# Altium project S7CAS-PLEIADES-CARTE-MERE_Pxx.PrjPcb (part 5 of 5)

## Sheet S7CAS-PLEIADES-CARTE-MERE_TO_BE_DELETED.SchDoc
size Tabloid; SheetNumber: 18; SheetTotal: 18; Size: 11x17; Sheet_Name: Sheet Description
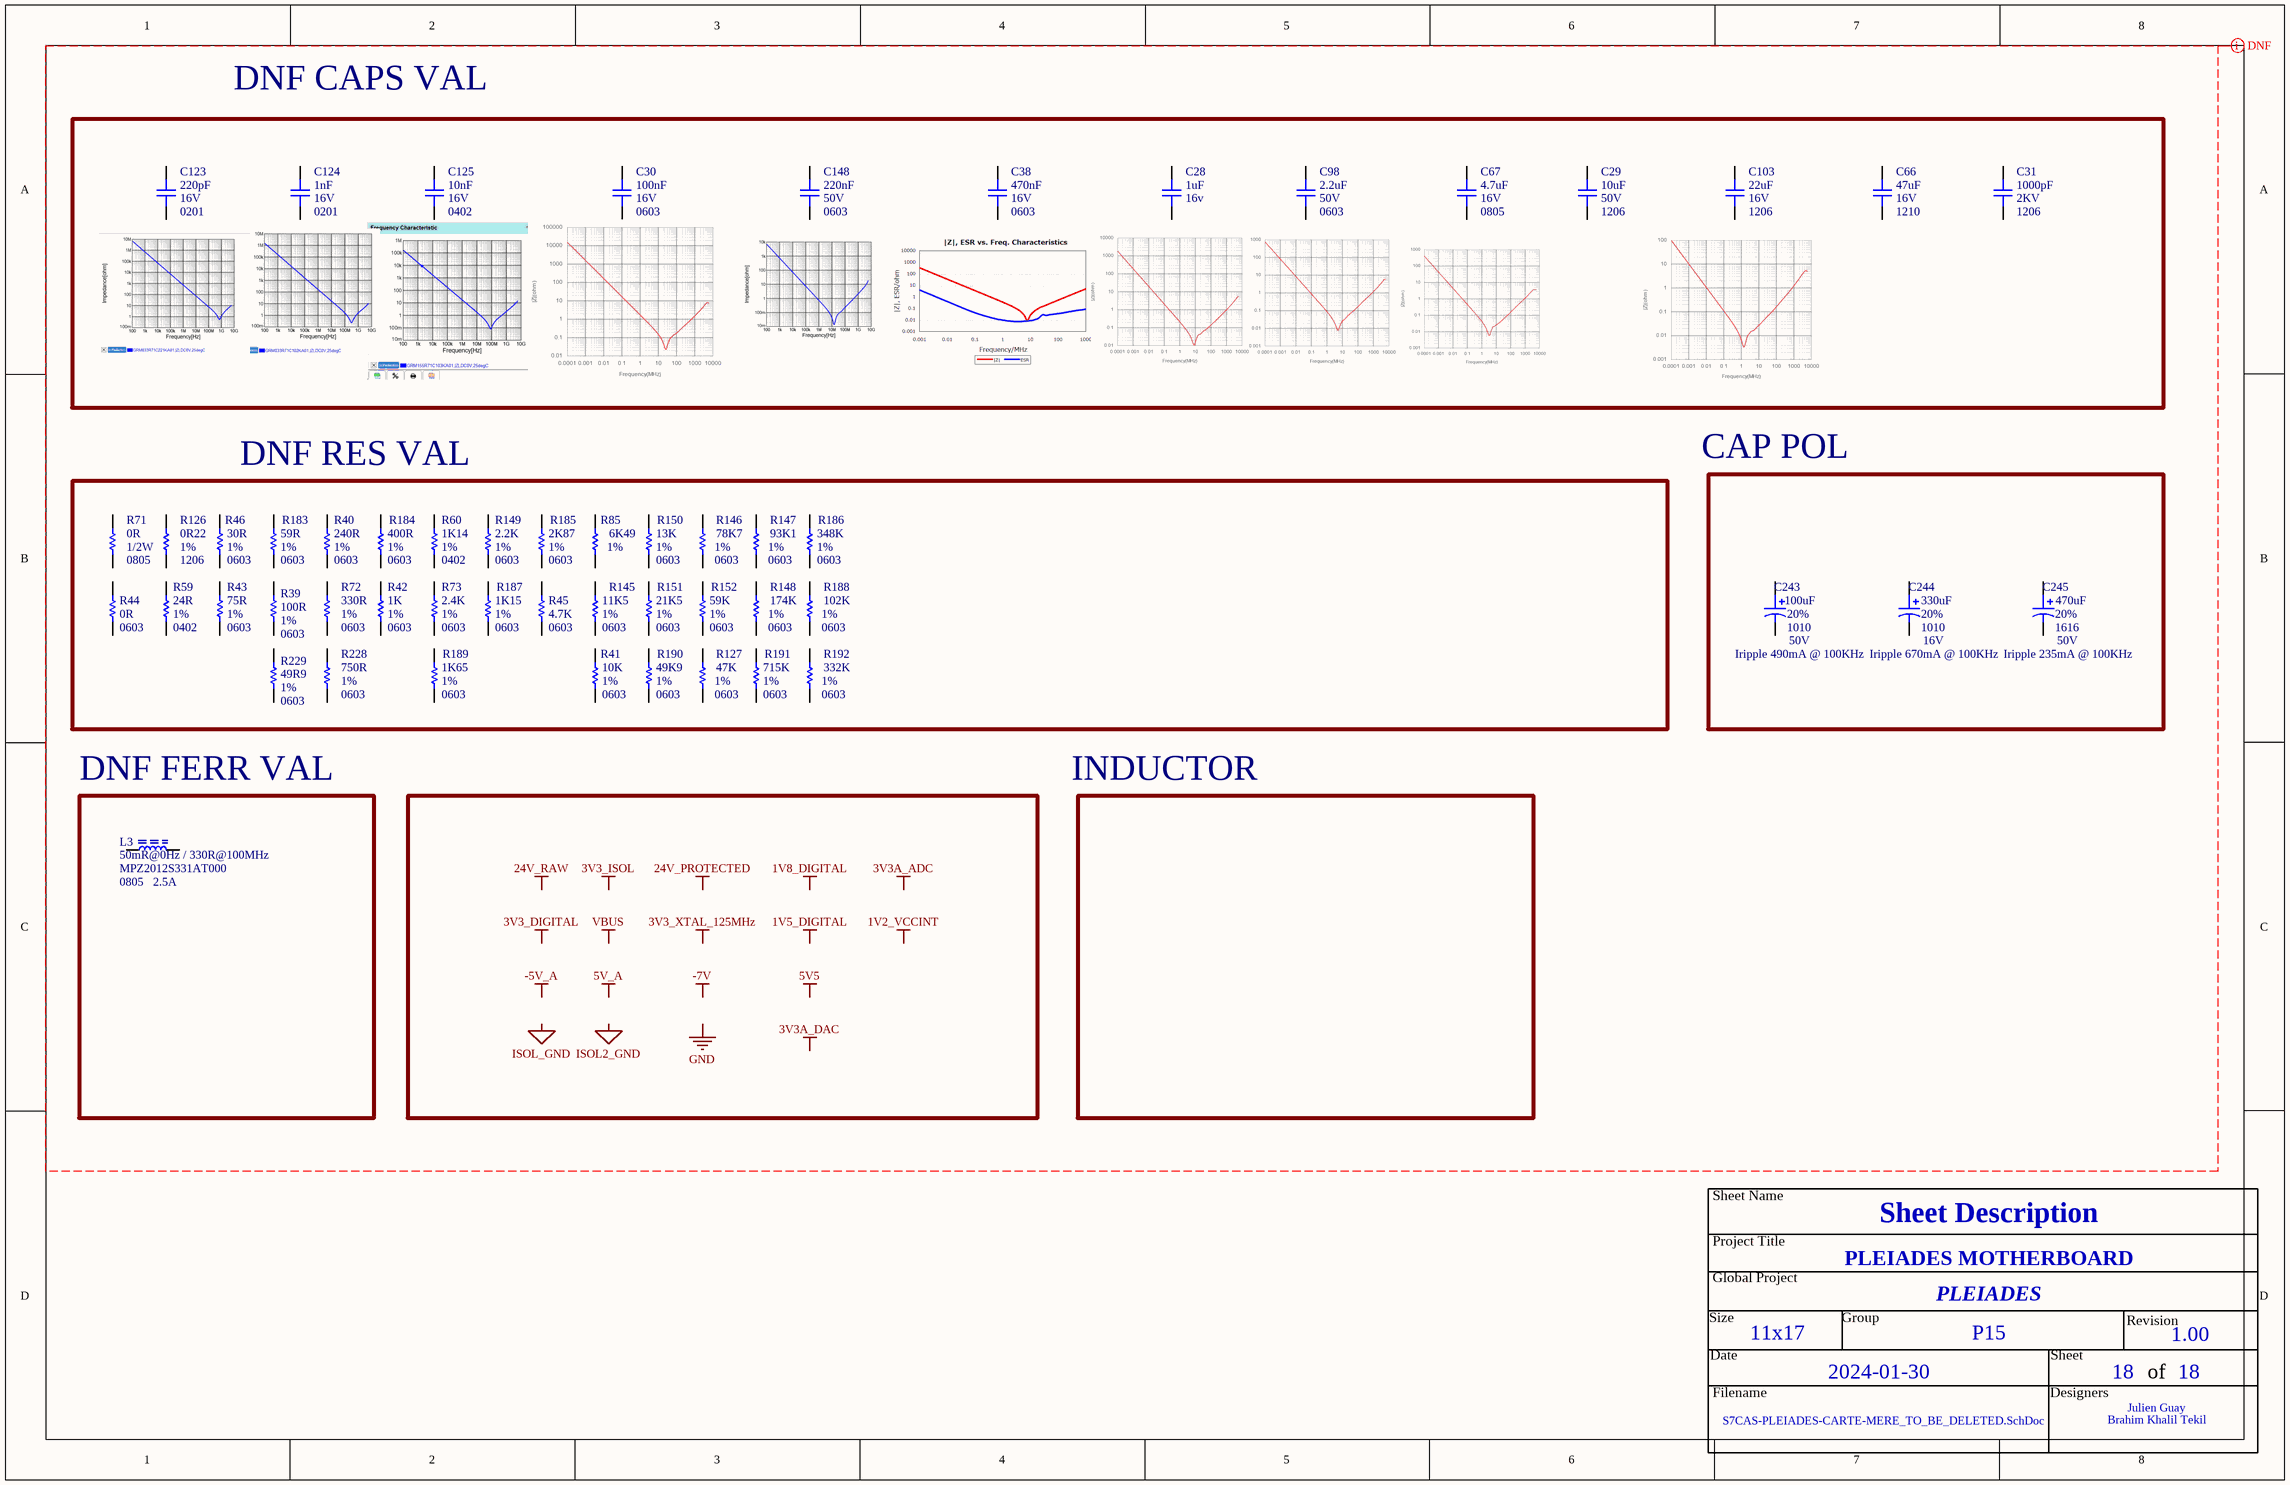
[diagram p16: S7CAS-PLEIADES-CARTE-MERE_TO_BE_DELETED.SchDoc]

### Parts
C28  value 1uF  Voltage: 16v  [CAP_0603]  (hidden comment: CAP - 0603)
C29  value 10uF  Voltage: 50V  Package: 1206  [CAP_1206]  (hidden comment: CAP - 1206)
C30  value 100nF  Voltage: 16V  Package: 0603  [CAP_0603]  (hidden comment: CAP - 0603)
C31  value 1000pF  Voltage: 2KV  Package: 1206  [CAP_1206]  (hidden comment: CAP - 1206)
C38  value 470nF  Voltage: 16V  Package: 0603  [CAP_0603]  (hidden comment: CAP - 0603)
C66  value 47uF  Voltage: 16V  Package: 1210  [CAP_1210]  (hidden comment: CAP - 1210)
C67  value 4.7uF  Voltage: 16V  Package: 0805  [CAP_0805]  (hidden comment: CAP - 0805)
C98  value 2.2uF  Voltage: 50V  Package: 0603  [CAP_0603]  (hidden comment: CAP - 0603)
C103  value 22uF  Voltage: 16V  Package: 1206  [CAP_1206]  (hidden comment: CAP - 1206)
C123  value 220pF  Voltage: 16V  Package: 0201  [CAP_0201]  (hidden comment: CAP - 0201)
C124  value 1nF  Voltage: 16V  Package: 0201  [CAP_0201]  (hidden comment: CAP - 0201)
C125  value 10nF  Voltage: 16V  Package: 0402  [CAP_0402]  (hidden comment: CAP - 0402)
C148  value 220nF  Voltage: 50V  Package: 0603  [CAP_0603]  (hidden comment: CAP - 0603)
C243  value 100uF  Voltage: 50V  Package: 1010  Precision: 20%  [CAP_ALU_1010_vishay]  (hidden comment: MAL215099101E3)
C244  value 330uF  Voltage: 16V  Package: 1010  Precision: 20%  [CAP_ALU_1010_vishay]  (hidden comment: MAL214699501E3)
C245  value 470uF  Voltage: 50V  Package: 1616  Precision: 20%  [CAP_ALU_1616_vishay]  (hidden comment: MAL214699108E3)
L3  value 50mR@0Hz / 330R@100MHz  Mfg Part Number: MPZ2012S331AT000  Current: 2.5A  Package: 0805  [FER_0805]  (hidden comment: FER - 0805)
R39  value 100R  Package: 0603  Precision: 1%  [RES_0603]  (hidden comment: RES - 0603)
R40  value 240R  Package: 0603  Precision: 1%  [RES_0603]  (hidden comment: RES - 0603)
R41  value 10K  Package: 0603  Precision: 1%  [RES_0603]  (hidden comment: RES - 0603)
R42  value 1K  Package: 0603  Precision: 1%  [RES_0603]  (hidden comment: RES - 0603)
R43  value 75R  Package: 0603  Precision: 1%  [RES_0603]  (hidden comment: RES - 0603)
R44  value 0R  Package: 0603  [RES_0603]  (hidden comment: RES - 0603)
R45  value 4.7K  Package: 0603  [RES_0603]  (hidden comment: RES - 0603)
R46  value 30R  Package: 0603  Precision: 1%  [RES_0603]  (hidden comment: RES - 0603)
R59  value 24R  Package: 0402  Precision: 1%  [RES_0402]  (hidden comment: RES - 0402)
R60  value 1K14  Package: 0402  Precision: 1%  [RES_0402]  (hidden comment: RES - 0402)
R71  value 0R  Power: 1/2W  Package: 0805  [RES_0805]  (hidden comment: RES - 0805)
R72  value 330R  Package: 0603  Precision: 1%  [RES_0603]  (hidden comment: RES - 0603)
R73  value 2.4K  Package: 0603  Precision: 1%  [RES_0603]  (hidden comment: RES - 0603)
R85  value 6K49  Precision: 1%  [RES_0402]  (hidden comment: RES - 0402)
R126  value 0R22  Package: 1206  Precision: 1%  [RES_1206]  (hidden comment: RES - 1206)
R127  value 47K  Package: 0603  Precision: 1%  [RES_0603]  (hidden comment: RES - 0603)
R145  value 11K5  Package: 0603  Precision: 1%  [RES_0603]  (hidden comment: RES - 0603)
R146  value 78K7  Package: 0603  Precision: 1%  [RES_0603]  (hidden comment: RES - 0603)
R147  value 93K1  Package: 0603  Precision: 1%  [RES_0603]  (hidden comment: RES - 0603)
R148  value 174K  Package: 0603  Precision: 1%  [RES_0603]  (hidden comment: RES - 0603)
R149  value 2.2K  Package: 0603  Precision: 1%  [RES_0603]  (hidden comment: RES - 0603)
R150  value 13K  Package: 0603  Precision: 1%  [RES_0603]  (hidden comment: RES - 0603)
R151  value 21K5  Package: 0603  Precision: 1%  [RES_0603]  (hidden comment: RES - 0603)
R152  value 59K  Package: 0603  Precision: 1%  [RES_0603]  (hidden comment: RES - 0603)
R183  value 59R  Package: 0603  Precision: 1%  [RES_0603]  (hidden comment: RES - 0603)
R184  value 400R  Package: 0603  Precision: 1%  [RES_0603]  (hidden comment: RES - 0603)
R185  value 2K87  Package: 0603  Precision: 1%  [RES_0603]  (hidden comment: RES - 0603)
R186  value 348K  Package: 0603  Precision: 1%  [RES_0603]  (hidden comment: RES - 0603)
R187  value 1K15  Package: 0603  Precision: 1%  [RES_0603]  (hidden comment: RES - 0603)
R188  value 102K  Package: 0603  Precision: 1%  [RES_0603]  (hidden comment: RES - 0603)
R189  value 1K65  Package: 0603  Precision: 1%  [RES_0603]  (hidden comment: RES - 0603)
R190  value 49K9  Package: 0603  Precision: 1%  [RES_0603]  (hidden comment: RES - 0603)
R191  value 715K  Package: 0603  Precision: 1%  [RES_0603]  (hidden comment: RES - 0603)
R192  value 332K  Package: 0603  Precision: 1%  [RES_0603]  (hidden comment: RES - 0603)
R228  value 750R  Package: 0603  Precision: 1%  [RES_0603]  (hidden comment: RES - 0603)
R229  value 49R9  Package: 0603  Precision: 1%  [RES_0603]  (hidden comment: RES - 0603)

### Blocks framed on the sheet
DNF RES VAL: R39-R46 R59 R60 R71-R73 R85 R126 R127 R145-R152 R183-R192 R228 R229
DNF FERR VAL: L3

### Nets

Not connected (* = marked no-connect by the designer): C28 1 2; C29 1 2; C30 1 2; C31 1 2; C38 1 2; C66 1 2; C67 1 2; C98 1 2; C103 1 2; C123 1 2; C124 1 2; C125 1 2; C148 1 2; C243 1 2; C244 1 2; C245 1 2; L3 1 2; R39 1 2; R40 1 2; R41 1 2; R42 1 2; R43 1 2; R44 1 2; R45 1 2; R46 1 2; R59 1 2; R60 1 2; R71 1 2; R72 1 2; R73 1 2; R85 1 2; R126 1 2; R127 1 2; R145 1 2; R146 1 2; R147 1 2; R148 1 2; R149 1 2; R150 1 2; R151 1 2; R152 1 2; R183 1 2; R184 1 2; R185 1 2; R186 1 2; R187 1 2; R188 1 2; R189 1 2; R190 1 2; R191 1 2; R192 1 2; R228 1 2; R229 1 2

### Layout directives
CompClassName: DNF_CLASS_COMPONENT: 1V2_VCCINT, 1V5_DIGITAL, 1V8_DIGITAL, 3V3_DIGITAL, 3V3_ISOL, 3V3_XTAL_125MHz, 3V3A_ADC, 3V3A_DAC, 5V5, 5V_A, 24V_PROTECTED, 24V_RAW, -5V_A, -7V, GND, ISOL2_GND, ISOL_GND, VBUS

### Notes on the sheet
- DNF CAPS VAL
- CAP POL
- (near C243) Iripple 490mA @ 100KHz
- (near C244) Iripple 670mA @ 100KHz
- (near C245) Iripple 235mA @ 100KHz
- INDUCTOR
- Labels drawn without touching a wire or pin: 1V2_VCCINT, 1V5_DIGITAL, 1V8_DIGITAL, 3V3_DIGITAL, 3V3_ISOL, 3V3_XTAL_125MHz, 3V3A_ADC, 3V3A_DAC, 5V5, 5V_A, 24V_PROTECTED, 24V_RAW, -5V_A, -7V, GND, ISOL2_GND, ISOL_GND, VBUS
- Sheet Name
- Project Title
- Global Project
- Revision
- Size
- Date
- Group
- Sheet
- of
- Filename
- Designers

### Library data of the parts
C28 C30 C38 C98 C148 = CAP - 0603: Precision: 10%; Current: *; CreatedBy: Jonathan Bouchard; Power: *; Supplier 1: Arrow Electronics
  C28: Package: 0603; Supplier Part Number 1: CL10B105MO8NNWC
  C30: Supplier Part Number 1: CL10B104KO8NNNC
  C38: Supplier Part Number 1: C1608X7R1C474K080AC
  C98: Supplier Part Number 1: GRM188R61H225KE11D
  C148: Supplier Part Number 1: GRM188R71H224KAC4D
C29 C31 C103 = CAP - 1206: Precision: 10%; Current: *; CreatedBy: Jonathan Bouchard; Power: *
  C29: Supplier 1: Avnet; Supplier Part Number 1: CL31A106MBHNNNE
  C31: Supplier 1: Arrow Electronics; Supplier Part Number 1: 1206GC102KAT1A
  C103: Supplier 1: Arrow Electronics; Supplier Part Number 1: CL31A226MOCLNNC
C66 = CAP - 1210: Precision: 10%; Current: *; CreatedBy: Jonathan Bouchard; Power: *; Supplier 1: Arrow Electronics; Supplier Part Number 1: CL32A476KOJNNNE
C67 = CAP - 0805: Precision: 10%; Current: *; CreatedBy: Jonathan Bouchard; Power: *; Supplier 1: Arrow Electronics; Supplier Part Number 1: CL21B475KOFNFNE
C123 C124 = CAP - 0201: Precision: 10%; Current: *; CreatedBy: Jonathan Bouchard; Power: *
  C123: Supplier 1: Arrow Electronics; Supplier Part Number 1: GRM033R71C221KA01D
  C124: Supplier 1: Avnet; Supplier Part Number 1: GRM033R71C102KA01J
C125 = CAP - 0402: Precision: 10%; Current: *; CreatedBy: Jonathan Bouchard; Power: *; Supplier 1: Arrow Electronics; Supplier Part Number 1: GRM155R61A224KE19D
C243 = CAP_ALU_MAL215099101E3: CAP - ALU 100uF 20% 50V - 1010; Current: 490mA; Mfg: Vishay Dale; Mfg Part Number: MAL215099101E3; HelpURL: http://www.vishay.com/docs/28395/150crz.pdf; CreatedBy: Jonathan Bouchard; Temperature: -55°C to 125°C; Power: *; Supplier 1: Digikey; Supplier Part Number 1: 4399PHDKR-ND
C244 = CAP_ALU_MAL214699501E3: CAP - ALU 330uF 20% 16V - 1010; Current: 750mA; Mfg: Vishay Dale; Mfg Part Number: MAL214699501E3; HelpURL: http://www.vishay.com/docs/28403/146cti.pdf; CreatedBy: Jonathan Bouchard; Temperature: -55°C to 125°C; Power: *; Supplier 1: Digikey; Supplier Part Number 1: 4405PHCT-ND
C245 = CAP_ALU_MAL214699108E3: CAP - ALU 470uF 20% 50V - 1616; Current: 1.3A; Mfg: Vishay Dale; Mfg Part Number: MAL214699108E3; HelpURL: http://www.vishay.com/docs/28403/146cti.pdf; CreatedBy: Jonathan Bouchard; Temperature: -55°C to 125°C; Power: *; Supplier 1: Digikey; Supplier Part Number 1: 4442PHCT-ND
L3 = FER - 0805: Mfg: TDK Corporation; Voltage: *; CreatedBy: Jonathan Bouchard; Power: *; Precision: *; Supplier 1: Arrow Electronics; Supplier Part Number 1: MPZ2012S331AT000
R44 R45 = RES - 0603: Precision: 1%; Current: *; CreatedBy: Jonathan Bouchard; Supplier 1: Arrow Electronics
  R44: Supplier Part Number 1: RMCF0603ZT0R00
  R45: Supplier Part Number 1: RMCF0603FT4K70
R59 R60 R85 = RES - 0402: Voltage: 50V; Power: 1/16W; Current: *; CreatedBy: Jonathan Bouchard
  R59: Supplier 1: Arrow Electronics; Supplier Part Number 1: RC0402FR-0724RL
  R60: Supplier 1: Digikey; Supplier Part Number 1: 2019-RN73H1ETTP1141F50CT-ND
  R85: Package: 0402; Supplier 1: Mouser; Supplier Part Number 1: 652-CR0402-FX6491GLF
R71 = RES - 0805: Precision: 1%; Current: *; CreatedBy: Jonathan Bouchard; Supplier 1: Arrow Electronics; Supplier Part Number 1: HCJ0805ZT0R00
R39-R43 R46 R72 R73 R127 R145-R152 R183-R192 R228 R229 = RES - 0603: Current: *; CreatedBy: Jonathan Bouchard
  R39: Supplier 1: Arrow Electronics; Supplier Part Number 1: RMCF0603FT100R
  R40: Supplier 1: Arrow Electronics; Supplier Part Number 1: RMCF0603FT240R
  R41: Supplier 1: Arrow Electronics; Supplier Part Number 1: RMCF0603FT10K0
  R42: Supplier 1: Arrow Electronics; Supplier Part Number 1: RMCF0603FT1K00
  R43: Supplier 1: Arrow Electronics; Supplier Part Number 1: RMCF0603FT75R0
  R46: Supplier 1: Arrow Electronics; Supplier Part Number 1: RMCF0603FT30R0
  R72: Supplier 1: Arrow Electronics; Supplier Part Number 1: RMCF0603FT330R
  R73: Supplier 1: Mouser; Supplier Part Number 1: 603-RC0603FR-132K4L
  R127: Supplier 1: Arrow Electronics; Supplier Part Number 1: RMCF0603FT47K0
  R145: Supplier 1: Arrow Electronics; Supplier Part Number 1: RMCF0603FT11K5
  R146: Supplier 1: Arrow Electronics; Supplier Part Number 1: RMCF0603FT78K7
  R147: Supplier 1: Arrow Electronics; Supplier Part Number 1: RMCF0603FT93K1
  R148: Supplier 1: Arrow Electronics; Supplier Part Number 1: RMCF0603FT174K
  R149: Supplier 1: Newark; Supplier Part Number 1: 94X1502
  R150: Supplier 1: Arrow Electronics; Supplier Part Number 1: RMCF0603FT13K0
  R151: Supplier 1: Arrow Electronics; Supplier Part Number 1: RMCF0603FT21K5
  R152: Supplier 1: Arrow Electronics; Supplier Part Number 1: RMCF0603FT59K0
  R183: Supplier 1: Digikey; Supplier Part Number 1: 738-RMCF0603FT59R0CT-ND
  R184: Supplier 1: Mouser; Supplier Part Number 1: 71-PAT0603E4000BST1
  R185: Supplier 1: Arrow Electronics; Supplier Part Number 1: RMCF0603FT2K87
  R186: Supplier 1: Arrow Electronics; Supplier Part Number 1: RMCF0603FT348K
  R187: Supplier 1: Arrow Electronics; Supplier Part Number 1: RMCF0603FT1K15
  R188: Supplier 1: Arrow Electronics; Supplier Part Number 1: RMCF0603FT102K
  R189: Supplier 1: Arrow Electronics; Supplier Part Number 1: RMCF0603FT1K65
  R190: Supplier 1: Digikey; Supplier Part Number 1: RMCF0603FG49K9CT-ND
  R191: Supplier 1: Digikey; Supplier Part Number 1: 738-RMCF0603FT715KCT-ND
  R192: Supplier 1: Arrow Electronics; Supplier Part Number 1: RMCF0603FT332K
  R228: Supplier 1: Arrow Electronics; Supplier Part Number 1: RMCF0603FT750R
  R229: Supplier 1: Mouser; Supplier Part Number 1: 667-ERJ-3EKF49R9V
R126 = RES - 1206: Current: *; CreatedBy: Jonathan Bouchard; Supplier 1: Mouser; Supplier Part Number 1: 667-ERJ-8RQFR22V

## Nets that join several sheets
1V2_VCCINT: S7CAS-PLEIADES-CARTE-MERE_Pxx_POWER_FPGA (32 pins), S7CAS-PLEIADES-CARTE-MERE_Pxx_ARBRE_ALIMENTATION (9 pins), S7CAS-PLEIADES-CARTE-MERE_Pxx_ARBRE_CAP_ARBRE (C264.1 C265.2 R242.2), S7CAS-PLEIADES-CARTE-MERE_Pxx_MECANICAL (TP26.1)
1V5_DIGITAL: S7CAS-PLEIADES-CARTE-MERE_Pxx_FPGA_bank0_1_5 (6 pins), S7CAS-PLEIADES-CARTE-MERE_Pxx_DDR (26 pins), S7CAS-PLEIADES-CARTE-MERE_Pxx_POWER_FPGA (6 pins), S7CAS-PLEIADES-CARTE-MERE_Pxx_ARBRE_ALIMENTATION (11 pins), S7CAS-PLEIADES-CARTE-MERE_Pxx_ARBRE_CAP_ARBRE (5 pins), S7CAS-PLEIADES-CARTE-MERE_Pxx_MECANICAL (TP25.1)
1V8_DIGITAL: S7CAS-PLEIADES-CARTE-MERE_Pxx_CNA (16 pins), S7CAS-PLEIADES-CARTE-MERE_Pxx_CAN (15 pins), S7CAS-PLEIADES-CARTE-MERE_Pxx_ARBRE_ALIMENTATION (9 pins), S7CAS-PLEIADES-CARTE-MERE_Pxx_ARBRE_CAP_ARBRE (C256.1 C257.2 R243.2), S7CAS-PLEIADES-CARTE-MERE_Pxx_MECANICAL (TP20.1)
3V3_DIGITAL: S7CAS-PLEIADES-CARTE-MERE_Pxx_FPGA_bank0_1_5 (21 pins), S7CAS-PLEIADES-CARTE-MERE_Pxx_FPGA_bank3 (10 pins), S7CAS-PLEIADES-CARTE-MERE_Pxx_FPGA_bank2_4 (26 pins), S7CAS-PLEIADES-CARTE-MERE_Pxx_POWER_FPGA (62 pins), S7CAS-PLEIADES-CARTE-MERE_Pxx_DEBUG_USB (19 pins), S7CAS-PLEIADES-CARTE-MERE_Pxx_PHY (11 pins), S7CAS-PLEIADES-CARTE-MERE_Pxx_FLASH_PHY_CLOCK (30 pins), S7CAS-PLEIADES-CARTE-MERE_Pxx_MOTEUR (7 pins), S7CAS-PLEIADES-CARTE-MERE_Pxx_IO_SENSOR (18 pins), S7CAS-PLEIADES-CARTE-MERE_Pxx_ARBRE_ALIMENTATION (12 pins), S7CAS-PLEIADES-CARTE-MERE_Pxx_ARBRE_CAP_ARBRE (25 pins), S7CAS-PLEIADES-CARTE-MERE_Pxx_MECANICAL (TP22.1)
3v3_ISOL: S7CAS-PLEIADES-CARTE-MERE_Pxx_DEBUG_USB (C33.2 ISO1.3 R49.2 R51.2), S7CAS-PLEIADES-CARTE-MERE_Pxx_MECANICAL (TP18.1)
3V3_XTAL_25MHz: S7CAS-PLEIADES-CARTE-MERE_Pxx_PHY (R81.2 Y2.4), S7CAS-PLEIADES-CARTE-MERE_Pxx_ARBRE_CAP_ARBRE (5 pins)
3V3_XTAL_125MHz: S7CAS-PLEIADES-CARTE-MERE_Pxx_FLASH_PHY_CLOCK (R26.2 Y1.6), S7CAS-PLEIADES-CARTE-MERE_Pxx_ARBRE_CAP_ARBRE (6 pins), S7CAS-PLEIADES-CARTE-MERE_Pxx_MECANICAL (TP24.1)
3V3A_ADC: S7CAS-PLEIADES-CARTE-MERE_Pxx_CAN (14 pins), S7CAS-PLEIADES-CARTE-MERE_Pxx_ARBRE_ALIMENTATION (U25.1 U25.3 U25.20), S7CAS-PLEIADES-CARTE-MERE_Pxx_ARBRE_CAP_ARBRE (C276.2 R238.2), S7CAS-PLEIADES-CARTE-MERE_Pxx_MECANICAL (TP21.1)
3V3A_DAC: S7CAS-PLEIADES-CARTE-MERE_Pxx_CNA (15 pins), S7CAS-PLEIADES-CARTE-MERE_Pxx_ARBRE_ALIMENTATION (U21.1 U21.3 U21.20), S7CAS-PLEIADES-CARTE-MERE_Pxx_ARBRE_CAP_ARBRE (C278.2 R239.2), S7CAS-PLEIADES-CARTE-MERE_Pxx_MECANICAL (TP36.1)
5V5: S7CAS-PLEIADES-CARTE-MERE_Pxx_ARBRE_ALIMENTATION (23 pins), S7CAS-PLEIADES-CARTE-MERE_Pxx_ARBRE_CAP_ARBRE (14 pins), S7CAS-PLEIADES-CARTE-MERE_Pxx_MECANICAL (TP31.1)
5V_A: S7CAS-PLEIADES-CARTE-MERE_Pxx_CNA (9 pins), S7CAS-PLEIADES-CARTE-MERE_Pxx_CAN (14 pins), S7CAS-PLEIADES-CARTE-MERE_Pxx_ARBRE_ALIMENTATION (U28.1 U28.3 U28.20), S7CAS-PLEIADES-CARTE-MERE_Pxx_ARBRE_CAP_ARBRE (C280.2 R240.2), S7CAS-PLEIADES-CARTE-MERE_Pxx_MECANICAL (TP29.1)
24V_PROTECTED: S7CAS-PLEIADES-CARTE-MERE_Pxx_MOTEUR (7 pins), S7CAS-PLEIADES-CARTE-MERE_Pxx_ARBRE_ALIMENTATION (7 pins), S7CAS-PLEIADES-CARTE-MERE_Pxx_ARBRE_CAP_ARBRE (7 pins), S7CAS-PLEIADES-CARTE-MERE_Pxx_MECANICAL (TP19.1)
24V_RAW: S7CAS-PLEIADES-CARTE-MERE_Pxx_ARBRE_ALIMENTATION (F1.1 J8.1 J8.2 J8.3), S7CAS-PLEIADES-CARTE-MERE_Pxx_ARBRE_CAP_ARBRE (R249.2), S7CAS-PLEIADES-CARTE-MERE_Pxx_MECANICAL (TP17.1)
-5V: S7CAS-PLEIADES-CARTE-MERE_Pxx_CNA (9 pins), S7CAS-PLEIADES-CARTE-MERE_Pxx_CAN (12 pins), S7CAS-PLEIADES-CARTE-MERE_Pxx_ARBRE_ALIMENTATION (R178.2 U27.1 U27.20)
-5V_A: S7CAS-PLEIADES-CARTE-MERE_Pxx_ARBRE_CAP_ARBRE (C282.2), S7CAS-PLEIADES-CARTE-MERE_Pxx_MECANICAL (TP28.1)
-7V: S7CAS-PLEIADES-CARTE-MERE_Pxx_ARBRE_ALIMENTATION (23 pins), S7CAS-PLEIADES-CARTE-MERE_Pxx_ARBRE_CAP_ARBRE (C281.2 C285.2 C286.2), S7CAS-PLEIADES-CARTE-MERE_Pxx_MECANICAL (TP30.1)
ISOL2_GND: S7CAS-PLEIADES-CARTE-MERE_Pxx_PHY (C23.1 D8.3 D8.8), S7CAS-PLEIADES-CARTE-MERE_Pxx_MECANICAL (TP33.1)
ISOL_GND: S7CAS-PLEIADES-CARTE-MERE_Pxx_DEBUG_USB (9 pins), S7CAS-PLEIADES-CARTE-MERE_Pxx_MECANICAL (TP32.1)
nCS: S7CAS-PLEIADES-CARTE-MERE_Pxx_FPGA_bank0_1_5 (5 pins), S7CAS-PLEIADES-CARTE-MERE_Pxx_DDR (32 pins), S7CAS-PLEIADES-CARTE-MERE_Pxx_FPGA_bank2_4 (7 pins), S7CAS-PLEIADES-CARTE-MERE_Pxx_POWER_FPGA (128 pins), S7CAS-PLEIADES-CARTE-MERE_Pxx_DEBUG_USB (15 pins), S7CAS-PLEIADES-CARTE-MERE_Pxx_PHY (21 pins), S7CAS-PLEIADES-CARTE-MERE_Pxx_FLASH_PHY_CLOCK (19 pins), S7CAS-PLEIADES-CARTE-MERE_Pxx_CNA (70 pins), S7CAS-PLEIADES-CARTE-MERE_Pxx_CAN (66 pins), S7CAS-PLEIADES-CARTE-MERE_Pxx_MOTEUR (30 pins), S7CAS-PLEIADES-CARTE-MERE_Pxx_IO_SENSOR (18 pins), S7CAS-PLEIADES-CARTE-MERE_Pxx_ARBRE_ALIMENTATION (91 pins), S7CAS-PLEIADES-CARTE-MERE_Pxx_ARBRE_CAP_ARBRE (70 pins), S7CAS-PLEIADES-CARTE-MERE_Pxx_MECANICAL (TP27.1 TP34.1 TP35.1)
VBUS: S7CAS-PLEIADES-CARTE-MERE_Pxx_DEBUG_USB (5 pins), S7CAS-PLEIADES-CARTE-MERE_Pxx_MECANICAL (TP23.1)
VTT: S7CAS-PLEIADES-CARTE-MERE_Pxx_DDR (21 pins), S7CAS-PLEIADES-CARTE-MERE_Pxx_ARBRE_ALIMENTATION (U16.3 U16.5), S7CAS-PLEIADES-CARTE-MERE_Pxx_ARBRE_CAP_ARBRE (C172.2 C173.2 C174.2)
VTT_REF: S7CAS-PLEIADES-CARTE-MERE_Pxx_FPGA_bank0_1_5 (C13.2 C14.2 U1.A23 U1.L21), S7CAS-PLEIADES-CARTE-MERE_Pxx_DDR (C11.2 U3.H1 U3.M8), S7CAS-PLEIADES-CARTE-MERE_Pxx_ARBRE_ALIMENTATION (C5.2 U16.6)
: S7CAS-PLEIADES-CARTE-MERE_Pxx_FPGA_bank3 (U17.W7), S7CAS-PLEIADES-CARTE-MERE_Pxx_CAN (U7.42)
~{RESET}: S7CAS-PLEIADES-CARTE-MERE_Pxx_FPGA_bank0_1_5 (R7.2 U1.D23), S7CAS-PLEIADES-CARTE-MERE_Pxx_DDR (U3.T2)
A0: S7CAS-PLEIADES-CARTE-MERE_Pxx_FPGA_bank0_1_5 (U1.B24), S7CAS-PLEIADES-CARTE-MERE_Pxx_DDR (R8.2 U3.N3)
A1: S7CAS-PLEIADES-CARTE-MERE_Pxx_FPGA_bank0_1_5 (U1.A25), S7CAS-PLEIADES-CARTE-MERE_Pxx_DDR (R9.2 U3.P7)
A2: S7CAS-PLEIADES-CARTE-MERE_Pxx_FPGA_bank0_1_5 (U1.G24), S7CAS-PLEIADES-CARTE-MERE_Pxx_DDR (R10.2 U3.P3)
A3: S7CAS-PLEIADES-CARTE-MERE_Pxx_FPGA_bank0_1_5 (U1.B25), S7CAS-PLEIADES-CARTE-MERE_Pxx_DDR (R11.2 U3.N2)
A4: S7CAS-PLEIADES-CARTE-MERE_Pxx_FPGA_bank0_1_5 (U1.G22), S7CAS-PLEIADES-CARTE-MERE_Pxx_DDR (R12.2 U3.P8)
A5: S7CAS-PLEIADES-CARTE-MERE_Pxx_FPGA_bank0_1_5 (U1.K20), S7CAS-PLEIADES-CARTE-MERE_Pxx_DDR (R13.2 U3.P2)
A6: S7CAS-PLEIADES-CARTE-MERE_Pxx_FPGA_bank0_1_5 (U1.K21), S7CAS-PLEIADES-CARTE-MERE_Pxx_DDR (R14.2 U3.R8)
A7: S7CAS-PLEIADES-CARTE-MERE_Pxx_FPGA_bank0_1_5 (U1.G23), S7CAS-PLEIADES-CARTE-MERE_Pxx_DDR (R15.2 U3.R2)
A8: S7CAS-PLEIADES-CARTE-MERE_Pxx_FPGA_bank0_1_5 (U1.H20), S7CAS-PLEIADES-CARTE-MERE_Pxx_DDR (R16.2 U3.T8)
A9: S7CAS-PLEIADES-CARTE-MERE_Pxx_FPGA_bank0_1_5 (U1.H21), S7CAS-PLEIADES-CARTE-MERE_Pxx_DDR (R17.2 U3.R3)
A10: S7CAS-PLEIADES-CARTE-MERE_Pxx_FPGA_bank0_1_5 (U1.H22), S7CAS-PLEIADES-CARTE-MERE_Pxx_DDR (R18.2 U3.L7)
A11: S7CAS-PLEIADES-CARTE-MERE_Pxx_FPGA_bank0_1_5 (U1.C24), S7CAS-PLEIADES-CARTE-MERE_Pxx_DDR (R19.2 U3.R7)
A12: S7CAS-PLEIADES-CARTE-MERE_Pxx_FPGA_bank0_1_5 (U1.D22), S7CAS-PLEIADES-CARTE-MERE_Pxx_DDR (R20.2 U3.N7)
A13: S7CAS-PLEIADES-CARTE-MERE_Pxx_FPGA_bank0_1_5 (U1.G20), S7CAS-PLEIADES-CARTE-MERE_Pxx_DDR (R21.2 U3.T3)
ADC_CLK_OUT_N: S7CAS-PLEIADES-CARTE-MERE_Pxx_FPGA_bank3 (U17.T1), S7CAS-PLEIADES-CARTE-MERE_Pxx_CAN (U7.56)
ADC_CLK_OUT_P: S7CAS-PLEIADES-CARTE-MERE_Pxx_FPGA_bank3 (U17.T3), S7CAS-PLEIADES-CARTE-MERE_Pxx_CAN (U7.57)
ADC_CTRL1: S7CAS-PLEIADES-CARTE-MERE_Pxx_FPGA_bank3 (U17.T4), S7CAS-PLEIADES-CARTE-MERE_Pxx_CAN (U7.35)
ADC_CTRL2: S7CAS-PLEIADES-CARTE-MERE_Pxx_FPGA_bank3 (U17.R7), S7CAS-PLEIADES-CARTE-MERE_Pxx_CAN (U7.36)
ADC_CTRL3: S7CAS-PLEIADES-CARTE-MERE_Pxx_FPGA_bank3 (U17.R6), S7CAS-PLEIADES-CARTE-MERE_Pxx_CAN (U7.37)
ADC_RESET: S7CAS-PLEIADES-CARTE-MERE_Pxx_FPGA_bank3 (U17.R10), S7CAS-PLEIADES-CARTE-MERE_Pxx_CAN (U7.12)
ADC_SCLK: S7CAS-PLEIADES-CARTE-MERE_Pxx_FPGA_bank3 (U17.T9), S7CAS-PLEIADES-CARTE-MERE_Pxx_CAN (U7.13)
ADC_SDATA: S7CAS-PLEIADES-CARTE-MERE_Pxx_FPGA_bank3 (U17.U3), S7CAS-PLEIADES-CARTE-MERE_Pxx_CAN (U7.14)
ADC_SDOUT: S7CAS-PLEIADES-CARTE-MERE_Pxx_FPGA_bank3 (U17.T8), S7CAS-PLEIADES-CARTE-MERE_Pxx_CAN (U7.64)
ADC_SEN: S7CAS-PLEIADES-CARTE-MERE_Pxx_FPGA_bank3 (U17.U4), S7CAS-PLEIADES-CARTE-MERE_Pxx_CAN (U7.15)
BA0: S7CAS-PLEIADES-CARTE-MERE_Pxx_FPGA_bank0_1_5 (U1.H18), S7CAS-PLEIADES-CARTE-MERE_Pxx_DDR (R22.2 U3.M2)
BA1: S7CAS-PLEIADES-CARTE-MERE_Pxx_FPGA_bank0_1_5 (U1.G19), S7CAS-PLEIADES-CARTE-MERE_Pxx_DDR (R23.2 U3.N8)
BA2: S7CAS-PLEIADES-CARTE-MERE_Pxx_FPGA_bank0_1_5 (U1.E24), S7CAS-PLEIADES-CARTE-MERE_Pxx_DDR (R24.2 U3.M3)
CCLK: S7CAS-PLEIADES-CARTE-MERE_Pxx_FPGA_bank2_4 (R65.1 U1.AD22), S7CAS-PLEIADES-CARTE-MERE_Pxx_FLASH_PHY_CLOCK (U12.16)
CK_N: S7CAS-PLEIADES-CARTE-MERE_Pxx_FPGA_bank0_1_5 (U1.C26), S7CAS-PLEIADES-CARTE-MERE_Pxx_DDR (R25.1 U3.K7)
CK_P: S7CAS-PLEIADES-CARTE-MERE_Pxx_FPGA_bank0_1_5 (U1.C25), S7CAS-PLEIADES-CARTE-MERE_Pxx_DDR (R25.2 U3.J7)
CKE: S7CAS-PLEIADES-CARTE-MERE_Pxx_FPGA_bank0_1_5 (R6.2 U1.F22), S7CAS-PLEIADES-CARTE-MERE_Pxx_DDR (R27.2 U3.K9)
CLK_100MHz_N: S7CAS-PLEIADES-CARTE-MERE_Pxx_FPGA_bank0_1_5 (U1.C14), S7CAS-PLEIADES-CARTE-MERE_Pxx_FLASH_PHY_CLOCK (U4.28)
CLK_100MHz_P: S7CAS-PLEIADES-CARTE-MERE_Pxx_FPGA_bank0_1_5 (U1.D14), S7CAS-PLEIADES-CARTE-MERE_Pxx_FLASH_PHY_CLOCK (U4.27)
CLK_200MHz_N: S7CAS-PLEIADES-CARTE-MERE_Pxx_FLASH_PHY_CLOCK (U4.20), S7CAS-PLEIADES-CARTE-MERE_Pxx_CAN (C133.2 R217.2)
CLK_200MHz_P: S7CAS-PLEIADES-CARTE-MERE_Pxx_FLASH_PHY_CLOCK (U4.19), S7CAS-PLEIADES-CARTE-MERE_Pxx_CAN (C132.2 R216.2)
CLK_400MHz_N: S7CAS-PLEIADES-CARTE-MERE_Pxx_FLASH_PHY_CLOCK (U4.17), S7CAS-PLEIADES-CARTE-MERE_Pxx_CNA (R215.2 U6.4)
CLK_400MHz_P: S7CAS-PLEIADES-CARTE-MERE_Pxx_FLASH_PHY_CLOCK (U4.16), S7CAS-PLEIADES-CARTE-MERE_Pxx_CNA (R214.2 U6.3)
COL: S7CAS-PLEIADES-CARTE-MERE_Pxx_FPGA_bank0_1_5 (U1.E10), S7CAS-PLEIADES-CARTE-MERE_Pxx_PHY (R155.1)
CRS: S7CAS-PLEIADES-CARTE-MERE_Pxx_FPGA_bank0_1_5 (U1.F10), S7CAS-PLEIADES-CARTE-MERE_Pxx_PHY (R156.1)
CSO_B: S7CAS-PLEIADES-CARTE-MERE_Pxx_FPGA_bank2_4 (R66.1 U1.AF4), S7CAS-PLEIADES-CARTE-MERE_Pxx_FLASH_PHY_CLOCK (U12.7)
D0: S7CAS-PLEIADES-CARTE-MERE_Pxx_FPGA_bank0_1_5 (U1.G25), S7CAS-PLEIADES-CARTE-MERE_Pxx_DDR (U3.E3)
D0_N: S7CAS-PLEIADES-CARTE-MERE_Pxx_FPGA_bank2_4 (U1.W12), S7CAS-PLEIADES-CARTE-MERE_Pxx_CNA (R194.2 U6.28)
D0_P: S7CAS-PLEIADES-CARTE-MERE_Pxx_FPGA_bank2_4 (U1.V12), S7CAS-PLEIADES-CARTE-MERE_Pxx_CNA (R193.2 U6.27)
D1: S7CAS-PLEIADES-CARTE-MERE_Pxx_FPGA_bank0_1_5 (U1.G26), S7CAS-PLEIADES-CARTE-MERE_Pxx_DDR (U3.F7)
D1_N: S7CAS-PLEIADES-CARTE-MERE_Pxx_FPGA_bank2_4 (U1.AF11), S7CAS-PLEIADES-CARTE-MERE_Pxx_CNA (R196.2 U6.26)
D1_P: S7CAS-PLEIADES-CARTE-MERE_Pxx_FPGA_bank2_4 (U1.AE11), S7CAS-PLEIADES-CARTE-MERE_Pxx_CNA (R195.2 U6.25)
D2: S7CAS-PLEIADES-CARTE-MERE_Pxx_FPGA_bank0_1_5 (U1.H24), S7CAS-PLEIADES-CARTE-MERE_Pxx_DDR (U3.F2)
D2_N: S7CAS-PLEIADES-CARTE-MERE_Pxx_FPGA_bank2_4 (U1.AF9), S7CAS-PLEIADES-CARTE-MERE_Pxx_CNA (R198.2 U6.24)
D2_P: S7CAS-PLEIADES-CARTE-MERE_Pxx_FPGA_bank2_4 (U1.AE9), S7CAS-PLEIADES-CARTE-MERE_Pxx_CNA (R197.2 U6.23)
D3: S7CAS-PLEIADES-CARTE-MERE_Pxx_FPGA_bank0_1_5 (U1.H26), S7CAS-PLEIADES-CARTE-MERE_Pxx_DDR (U3.F8)
D3_N: S7CAS-PLEIADES-CARTE-MERE_Pxx_FPGA_bank2_4 (U1.AF10), S7CAS-PLEIADES-CARTE-MERE_Pxx_CNA (R200.2 U6.22)
D3_P: S7CAS-PLEIADES-CARTE-MERE_Pxx_FPGA_bank2_4 (U1.AD10), S7CAS-PLEIADES-CARTE-MERE_Pxx_CNA (R199.2 U6.21)
D4: S7CAS-PLEIADES-CARTE-MERE_Pxx_FPGA_bank0_1_5 (U1.E25), S7CAS-PLEIADES-CARTE-MERE_Pxx_DDR (U3.H3)
D4_N: S7CAS-PLEIADES-CARTE-MERE_Pxx_FPGA_bank2_4 (U1.U12), S7CAS-PLEIADES-CARTE-MERE_Pxx_CNA (R202.2 U6.16)
D4_P: S7CAS-PLEIADES-CARTE-MERE_Pxx_FPGA_bank2_4 (U1.U13), S7CAS-PLEIADES-CARTE-MERE_Pxx_CNA (R201.2 U6.15)
D5: S7CAS-PLEIADES-CARTE-MERE_Pxx_FPGA_bank0_1_5 (U1.E26), S7CAS-PLEIADES-CARTE-MERE_Pxx_DDR (U3.H8)
D5_N: S7CAS-PLEIADES-CARTE-MERE_Pxx_FPGA_bank2_4 (U1.AB10), S7CAS-PLEIADES-CARTE-MERE_Pxx_CNA (R204.2 U6.14)
D5_P: S7CAS-PLEIADES-CARTE-MERE_Pxx_FPGA_bank2_4 (U1.Y10), S7CAS-PLEIADES-CARTE-MERE_Pxx_CNA (R203.2 U6.13)
D6: S7CAS-PLEIADES-CARTE-MERE_Pxx_FPGA_bank0_1_5 (U1.D24), S7CAS-PLEIADES-CARTE-MERE_Pxx_DDR (U3.G2)
D6_N: S7CAS-PLEIADES-CARTE-MERE_Pxx_FPGA_bank2_4 (U1.W11), S7CAS-PLEIADES-CARTE-MERE_Pxx_CNA (R206.2 U6.12)
D6_P: S7CAS-PLEIADES-CARTE-MERE_Pxx_FPGA_bank2_4 (U1.V11), S7CAS-PLEIADES-CARTE-MERE_Pxx_CNA (R205.2 U6.11)
D7: S7CAS-PLEIADES-CARTE-MERE_Pxx_FPGA_bank0_1_5 (U1.D26), S7CAS-PLEIADES-CARTE-MERE_Pxx_DDR (U3.H7)
D7_N: S7CAS-PLEIADES-CARTE-MERE_Pxx_FPGA_bank2_4 (U1.AF8), S7CAS-PLEIADES-CARTE-MERE_Pxx_CNA (R208.2 U6.10)
D7_P: S7CAS-PLEIADES-CARTE-MERE_Pxx_FPGA_bank2_4 (U1.AD8), S7CAS-PLEIADES-CARTE-MERE_Pxx_CNA (R207.2 U6.9)
D8: S7CAS-PLEIADES-CARTE-MERE_Pxx_FPGA_bank0_1_5 (U1.K24), S7CAS-PLEIADES-CARTE-MERE_Pxx_DDR (U3.D7)
D9: S7CAS-PLEIADES-CARTE-MERE_Pxx_FPGA_bank0_1_5 (U1.K26), S7CAS-PLEIADES-CARTE-MERE_Pxx_DDR (U3.C3)
D10: S7CAS-PLEIADES-CARTE-MERE_Pxx_FPGA_bank0_1_5 (U1.J25), S7CAS-PLEIADES-CARTE-MERE_Pxx_DDR (U3.C8)
D11: S7CAS-PLEIADES-CARTE-MERE_Pxx_FPGA_bank0_1_5 (U1.J26), S7CAS-PLEIADES-CARTE-MERE_Pxx_DDR (U3.C2)
D12: S7CAS-PLEIADES-CARTE-MERE_Pxx_FPGA_bank0_1_5 (U1.L25), S7CAS-PLEIADES-CARTE-MERE_Pxx_DDR (U3.A7)
D13: S7CAS-PLEIADES-CARTE-MERE_Pxx_FPGA_bank0_1_5 (U1.L26), S7CAS-PLEIADES-CARTE-MERE_Pxx_DDR (U3.A2)
D14: S7CAS-PLEIADES-CARTE-MERE_Pxx_FPGA_bank0_1_5 (U1.N25), S7CAS-PLEIADES-CARTE-MERE_Pxx_DDR (U3.B8)
D15: S7CAS-PLEIADES-CARTE-MERE_Pxx_FPGA_bank0_1_5 (U1.N26), S7CAS-PLEIADES-CARTE-MERE_Pxx_DDR (U3.A3)
DA0_N: S7CAS-PLEIADES-CARTE-MERE_Pxx_FPGA_bank3 (U17.AD5), S7CAS-PLEIADES-CARTE-MERE_Pxx_CAN (U7.40)
DA0_P: S7CAS-PLEIADES-CARTE-MERE_Pxx_FPGA_bank3 (U17.AC5), S7CAS-PLEIADES-CARTE-MERE_Pxx_CAN (U7.41)
DA2_P: S7CAS-PLEIADES-CARTE-MERE_Pxx_FPGA_bank3 (U17.W8), S7CAS-PLEIADES-CARTE-MERE_Pxx_CAN (U7.43)
DA4_N: S7CAS-PLEIADES-CARTE-MERE_Pxx_FPGA_bank3 (U17.AB5), S7CAS-PLEIADES-CARTE-MERE_Pxx_CAN (U7.44)
DA4_P: S7CAS-PLEIADES-CARTE-MERE_Pxx_FPGA_bank3 (U17.AA5), S7CAS-PLEIADES-CARTE-MERE_Pxx_CAN (U7.45)
DA6_N: S7CAS-PLEIADES-CARTE-MERE_Pxx_FPGA_bank3 (U17.V6), S7CAS-PLEIADES-CARTE-MERE_Pxx_CAN (U7.46)
DA6_P: S7CAS-PLEIADES-CARTE-MERE_Pxx_FPGA_bank3 (U17.V7), S7CAS-PLEIADES-CARTE-MERE_Pxx_CAN (U7.47)
DA8_N: S7CAS-PLEIADES-CARTE-MERE_Pxx_FPGA_bank3 (U17.AC3), S7CAS-PLEIADES-CARTE-MERE_Pxx_CAN (U7.50)
DA8_P: S7CAS-PLEIADES-CARTE-MERE_Pxx_FPGA_bank3 (U17.AB4), S7CAS-PLEIADES-CARTE-MERE_Pxx_CAN (U7.51)
DA10_N: S7CAS-PLEIADES-CARTE-MERE_Pxx_FPGA_bank3 (U17.V8), S7CAS-PLEIADES-CARTE-MERE_Pxx_CAN (U7.52)
DA10_P: S7CAS-PLEIADES-CARTE-MERE_Pxx_FPGA_bank3 (U17.W9), S7CAS-PLEIADES-CARTE-MERE_Pxx_CAN (U7.53)
DA12_N: S7CAS-PLEIADES-CARTE-MERE_Pxx_FPGA_bank3 (U17.AA3), S7CAS-PLEIADES-CARTE-MERE_Pxx_CAN (U7.54)
DA12_P: S7CAS-PLEIADES-CARTE-MERE_Pxx_FPGA_bank3 (U17.AA4), S7CAS-PLEIADES-CARTE-MERE_Pxx_CAN (U7.55)
DAC_REF_CLK_N: S7CAS-PLEIADES-CARTE-MERE_Pxx_FPGA_bank2_4 (U1.AF14), S7CAS-PLEIADES-CARTE-MERE_Pxx_CNA (U6.7)
DAC_REF_CLK_P: S7CAS-PLEIADES-CARTE-MERE_Pxx_FPGA_bank2_4 (U1.AD14), S7CAS-PLEIADES-CARTE-MERE_Pxx_CNA (U6.6)
DB0_N: S7CAS-PLEIADES-CARTE-MERE_Pxx_FPGA_bank3 (U17.AD7), S7CAS-PLEIADES-CARTE-MERE_Pxx_CAN (U7.60)
DB0_P: S7CAS-PLEIADES-CARTE-MERE_Pxx_FPGA_bank3 (U17.AC7), S7CAS-PLEIADES-CARTE-MERE_Pxx_CAN (U7.61)
DB2_N: S7CAS-PLEIADES-CARTE-MERE_Pxx_FPGA_bank3 (U17.AF2), S7CAS-PLEIADES-CARTE-MERE_Pxx_CAN (U7.62)
DB2_P: S7CAS-PLEIADES-CARTE-MERE_Pxx_FPGA_bank3 (U17.AE3), S7CAS-PLEIADES-CARTE-MERE_Pxx_CAN (U7.63)
DB4_N: S7CAS-PLEIADES-CARTE-MERE_Pxx_FPGA_bank3 (U17.AD4), S7CAS-PLEIADES-CARTE-MERE_Pxx_CAN (U7.2)
DB4_P: S7CAS-PLEIADES-CARTE-MERE_Pxx_FPGA_bank3 (U17.AC4), S7CAS-PLEIADES-CARTE-MERE_Pxx_CAN (U7.3)
DB6_N: S7CAS-PLEIADES-CARTE-MERE_Pxx_FPGA_bank3 (U17.AB8), S7CAS-PLEIADES-CARTE-MERE_Pxx_CAN (U7.4)
DB6_P: S7CAS-PLEIADES-CARTE-MERE_Pxx_FPGA_bank3 (U17.AA8), S7CAS-PLEIADES-CARTE-MERE_Pxx_CAN (U7.5)
DB8_N: S7CAS-PLEIADES-CARTE-MERE_Pxx_FPGA_bank3 (U17.Y6), S7CAS-PLEIADES-CARTE-MERE_Pxx_CAN (U7.6)
DB8_P: S7CAS-PLEIADES-CARTE-MERE_Pxx_FPGA_bank3 (U17.AA7), S7CAS-PLEIADES-CARTE-MERE_Pxx_CAN (U7.7)
DB10_N: S7CAS-PLEIADES-CARTE-MERE_Pxx_FPGA_bank3 (U17.AB6), S7CAS-PLEIADES-CARTE-MERE_Pxx_CAN (U7.8)
DB10_P: S7CAS-PLEIADES-CARTE-MERE_Pxx_FPGA_bank3 (U17.AB7), S7CAS-PLEIADES-CARTE-MERE_Pxx_CAN (U7.9)
DB12_N: S7CAS-PLEIADES-CARTE-MERE_Pxx_FPGA_bank3 (U17.Y8), S7CAS-PLEIADES-CARTE-MERE_Pxx_CAN (U7.10)
DB12_P: S7CAS-PLEIADES-CARTE-MERE_Pxx_FPGA_bank3 (U17.Y9), S7CAS-PLEIADES-CARTE-MERE_Pxx_CAN (U7.11)
DBG_LED0: S7CAS-PLEIADES-CARTE-MERE_Pxx_FPGA_bank3 (U17.R3), S7CAS-PLEIADES-CARTE-MERE_Pxx_IO_SENSOR (R226.2)
DBG_LED1: S7CAS-PLEIADES-CARTE-MERE_Pxx_FPGA_bank3 (U17.N6), S7CAS-PLEIADES-CARTE-MERE_Pxx_IO_SENSOR (R227.2)
DBG_LED2: S7CAS-PLEIADES-CARTE-MERE_Pxx_FPGA_bank3 (U17.P1), S7CAS-PLEIADES-CARTE-MERE_Pxx_IO_SENSOR (R223.2)
DBG_LED3: S7CAS-PLEIADES-CARTE-MERE_Pxx_FPGA_bank3 (U17.R9), S7CAS-PLEIADES-CARTE-MERE_Pxx_IO_SENSOR (R222.2)
DCI_N: S7CAS-PLEIADES-CARTE-MERE_Pxx_FPGA_bank2_4 (U1.AD9), S7CAS-PLEIADES-CARTE-MERE_Pxx_CNA (R210.2 U6.18)
DCI_P: S7CAS-PLEIADES-CARTE-MERE_Pxx_FPGA_bank2_4 (U1.AC9), S7CAS-PLEIADES-CARTE-MERE_Pxx_CNA (R209.2 U6.17)
FRAME_N: S7CAS-PLEIADES-CARTE-MERE_Pxx_FPGA_bank2_4 (U1.AB9), S7CAS-PLEIADES-CARTE-MERE_Pxx_CNA (R212.2 U6.20)
FRAME_P: S7CAS-PLEIADES-CARTE-MERE_Pxx_FPGA_bank2_4 (U1.AA9), S7CAS-PLEIADES-CARTE-MERE_Pxx_CNA (R211.2 U6.19)
HSWAPEN: S7CAS-PLEIADES-CARTE-MERE_Pxx_FPGA_bank0_1_5 (U1.A3), S7CAS-PLEIADES-CARTE-MERE_Pxx_FPGA_bank2_4 (R129.1)
INTRP: S7CAS-PLEIADES-CARTE-MERE_Pxx_FPGA_bank0_1_5 (U1.D10), S7CAS-PLEIADES-CARTE-MERE_Pxx_PHY (R77.1 U5.21)
LDM: S7CAS-PLEIADES-CARTE-MERE_Pxx_FPGA_bank0_1_5 (U1.J24), S7CAS-PLEIADES-CARTE-MERE_Pxx_DDR (U3.E7)
LDQS_N: S7CAS-PLEIADES-CARTE-MERE_Pxx_FPGA_bank0_1_5 (U1.F26), S7CAS-PLEIADES-CARTE-MERE_Pxx_DDR (U3.G3)
LDQS_P: S7CAS-PLEIADES-CARTE-MERE_Pxx_FPGA_bank0_1_5 (U1.F24), S7CAS-PLEIADES-CARTE-MERE_Pxx_DDR (U3.F3)
MDC: S7CAS-PLEIADES-CARTE-MERE_Pxx_FPGA_bank0_1_5 (U1.A9), S7CAS-PLEIADES-CARTE-MERE_Pxx_PHY (R154.1)
MDIO: S7CAS-PLEIADES-CARTE-MERE_Pxx_FPGA_bank0_1_5 (U1.C9), S7CAS-PLEIADES-CARTE-MERE_Pxx_PHY (R153.1)
MOSI: S7CAS-PLEIADES-CARTE-MERE_Pxx_FPGA_bank2_4 (U1.AF20), S7CAS-PLEIADES-CARTE-MERE_Pxx_FLASH_PHY_CLOCK (U12.15)
nCAS: S7CAS-PLEIADES-CARTE-MERE_Pxx_FPGA_bank0_1_5 (U1.J22), S7CAS-PLEIADES-CARTE-MERE_Pxx_DDR (R29.2 U3.K3)
NetM1_3: S7CAS-PLEIADES-CARTE-MERE_Pxx_FPGA_bank2_4 (U1.AF12), S7CAS-PLEIADES-CARTE-MERE_Pxx_DEBUG_USB (M1.3)
NetM1_4: S7CAS-PLEIADES-CARTE-MERE_Pxx_FPGA_bank2_4 (U1.AD12), S7CAS-PLEIADES-CARTE-MERE_Pxx_DEBUG_USB (M1.4)
NetM1_5: S7CAS-PLEIADES-CARTE-MERE_Pxx_FPGA_bank2_4 (U1.AD13), S7CAS-PLEIADES-CARTE-MERE_Pxx_DEBUG_USB (M1.5)
NetM1_6: S7CAS-PLEIADES-CARTE-MERE_Pxx_FPGA_bank2_4 (U1.AC13), S7CAS-PLEIADES-CARTE-MERE_Pxx_DEBUG_USB (M1.6)
NetR37_1: S7CAS-PLEIADES-CARTE-MERE_Pxx_FPGA_bank0_1_5 (U1.D7), S7CAS-PLEIADES-CARTE-MERE_Pxx_FLASH_PHY_CLOCK (R37.1 U4.25)
NetR67_1: S7CAS-PLEIADES-CARTE-MERE_Pxx_FPGA_bank2_4 (R67.1), S7CAS-PLEIADES-CARTE-MERE_Pxx_FLASH_PHY_CLOCK (U12.8)
NetR75_1: S7CAS-PLEIADES-CARTE-MERE_Pxx_FPGA_bank0_1_5 (U1.A8), S7CAS-PLEIADES-CARTE-MERE_Pxx_PHY (R75.1 U5.32)
NetR117_2: S7CAS-PLEIADES-CARTE-MERE_Pxx_FPGA_bank0_1_5 (U1.A7), S7CAS-PLEIADES-CARTE-MERE_Pxx_MOTEUR (R117.2)
NetU1_A5: S7CAS-PLEIADES-CARTE-MERE_Pxx_FPGA_bank0_1_5 (U1.A5), S7CAS-PLEIADES-CARTE-MERE_Pxx_MOTEUR (U8.19)
NetU1_A6: S7CAS-PLEIADES-CARTE-MERE_Pxx_FPGA_bank0_1_5 (U1.A6), S7CAS-PLEIADES-CARTE-MERE_Pxx_MOTEUR (U8.16)
NetU1_AA11: S7CAS-PLEIADES-CARTE-MERE_Pxx_FPGA_bank2_4 (U1.AA11), S7CAS-PLEIADES-CARTE-MERE_Pxx_CNA (U6.34)
NetU1_AA12: S7CAS-PLEIADES-CARTE-MERE_Pxx_FPGA_bank2_4 (U1.AA12), S7CAS-PLEIADES-CARTE-MERE_Pxx_CNA (U6.31)
NetU1_AB13: S7CAS-PLEIADES-CARTE-MERE_Pxx_FPGA_bank2_4 (U1.AB13), S7CAS-PLEIADES-CARTE-MERE_Pxx_CNA (U6.32)
NetU1_AC11: S7CAS-PLEIADES-CARTE-MERE_Pxx_FPGA_bank2_4 (U1.AC11), S7CAS-PLEIADES-CARTE-MERE_Pxx_CNA (U6.30)
NetU1_AC12: S7CAS-PLEIADES-CARTE-MERE_Pxx_FPGA_bank2_4 (U1.AC12), S7CAS-PLEIADES-CARTE-MERE_Pxx_CNA (U6.33)
NetU1_B8: S7CAS-PLEIADES-CARTE-MERE_Pxx_FPGA_bank0_1_5 (U1.B8), S7CAS-PLEIADES-CARTE-MERE_Pxx_FLASH_PHY_CLOCK (U4.14)
NetU1_C5: S7CAS-PLEIADES-CARTE-MERE_Pxx_FPGA_bank0_1_5 (U1.C5), S7CAS-PLEIADES-CARTE-MERE_Pxx_MOTEUR (U8.27)
NetU1_C6: S7CAS-PLEIADES-CARTE-MERE_Pxx_FPGA_bank0_1_5 (U1.C6), S7CAS-PLEIADES-CARTE-MERE_Pxx_FLASH_PHY_CLOCK (U4.37)
NetU1_C7: S7CAS-PLEIADES-CARTE-MERE_Pxx_FPGA_bank0_1_5 (U1.C7), S7CAS-PLEIADES-CARTE-MERE_Pxx_MOTEUR (U8.2)
NetU1_C8: S7CAS-PLEIADES-CARTE-MERE_Pxx_FPGA_bank0_1_5 (U1.C8), S7CAS-PLEIADES-CARTE-MERE_Pxx_FLASH_PHY_CLOCK (U4.23)
NetU1_D5: S7CAS-PLEIADES-CARTE-MERE_Pxx_FPGA_bank0_1_5 (U1.D5), S7CAS-PLEIADES-CARTE-MERE_Pxx_MOTEUR (U8.26)
NetU1_D8: S7CAS-PLEIADES-CARTE-MERE_Pxx_FPGA_bank0_1_5 (U1.D8), S7CAS-PLEIADES-CARTE-MERE_Pxx_FLASH_PHY_CLOCK (U4.24)
NetU1_E6: S7CAS-PLEIADES-CARTE-MERE_Pxx_FPGA_bank0_1_5 (U1.E6), S7CAS-PLEIADES-CARTE-MERE_Pxx_MOTEUR (U8.17)
NetU1_E8: S7CAS-PLEIADES-CARTE-MERE_Pxx_FPGA_bank0_1_5 (U1.E8), S7CAS-PLEIADES-CARTE-MERE_Pxx_FLASH_PHY_CLOCK (U4.12)
NetU1_E9: S7CAS-PLEIADES-CARTE-MERE_Pxx_FPGA_bank0_1_5 (U1.E9), S7CAS-PLEIADES-CARTE-MERE_Pxx_FLASH_PHY_CLOCK (U4.31)
NetU1_F9: S7CAS-PLEIADES-CARTE-MERE_Pxx_FPGA_bank0_1_5 (U1.F9), S7CAS-PLEIADES-CARTE-MERE_Pxx_FLASH_PHY_CLOCK (U4.22)
NetU1_G8: S7CAS-PLEIADES-CARTE-MERE_Pxx_FPGA_bank0_1_5 (U1.G8), S7CAS-PLEIADES-CARTE-MERE_Pxx_MOTEUR (U8.3)
NetU1_Y13: S7CAS-PLEIADES-CARTE-MERE_Pxx_FPGA_bank2_4 (U1.Y13), S7CAS-PLEIADES-CARTE-MERE_Pxx_CNA (U6.36)
nRAS: S7CAS-PLEIADES-CARTE-MERE_Pxx_FPGA_bank0_1_5 (U1.K22), S7CAS-PLEIADES-CARTE-MERE_Pxx_DDR (R28.2 U3.J3)
nWE: S7CAS-PLEIADES-CARTE-MERE_Pxx_FPGA_bank0_1_5 (U1.E23), S7CAS-PLEIADES-CARTE-MERE_Pxx_DDR (R30.2 U3.L3)
ODT: S7CAS-PLEIADES-CARTE-MERE_Pxx_FPGA_bank0_1_5 (R4.2 U1.B23 U1.B26), S7CAS-PLEIADES-CARTE-MERE_Pxx_DDR (U3.K1)
PME_N1/NWAYEN: S7CAS-PLEIADES-CARTE-MERE_Pxx_FPGA_bank0_1_5 (U1.C10), S7CAS-PLEIADES-CARTE-MERE_Pxx_PHY (R78.1 R79.1 U5.30)
PROGRAM_B: S7CAS-PLEIADES-CARTE-MERE_Pxx_FPGA_bank2_4 (9 pins), S7CAS-PLEIADES-CARTE-MERE_Pxx_DEBUG_USB (M1.9)
RXC: S7CAS-PLEIADES-CARTE-MERE_Pxx_FPGA_bank0_1_5 (U1.A13), S7CAS-PLEIADES-CARTE-MERE_Pxx_PHY (R163.1)
RXD0: S7CAS-PLEIADES-CARTE-MERE_Pxx_FPGA_bank0_1_5 (U1.D11), S7CAS-PLEIADES-CARTE-MERE_Pxx_PHY (R159.1)
RXD1: S7CAS-PLEIADES-CARTE-MERE_Pxx_FPGA_bank0_1_5 (U1.F11), S7CAS-PLEIADES-CARTE-MERE_Pxx_PHY (R160.1)
RXD2: S7CAS-PLEIADES-CARTE-MERE_Pxx_FPGA_bank0_1_5 (U1.C11), S7CAS-PLEIADES-CARTE-MERE_Pxx_PHY (R161.1)
RXD3: S7CAS-PLEIADES-CARTE-MERE_Pxx_FPGA_bank0_1_5 (U1.A11), S7CAS-PLEIADES-CARTE-MERE_Pxx_PHY (R162.1)
RXDV: S7CAS-PLEIADES-CARTE-MERE_Pxx_FPGA_bank0_1_5 (U1.B10), S7CAS-PLEIADES-CARTE-MERE_Pxx_PHY (R157.1)
RXER: S7CAS-PLEIADES-CARTE-MERE_Pxx_FPGA_bank0_1_5 (U1.A10), S7CAS-PLEIADES-CARTE-MERE_Pxx_PHY (R158.1)
TXC: S7CAS-PLEIADES-CARTE-MERE_Pxx_FPGA_bank0_1_5 (U1.C13), S7CAS-PLEIADES-CARTE-MERE_Pxx_PHY (R170.1)
TXD0: S7CAS-PLEIADES-CARTE-MERE_Pxx_FPGA_bank0_1_5 (U1.D12), S7CAS-PLEIADES-CARTE-MERE_Pxx_PHY (R166.1)
TXD1: S7CAS-PLEIADES-CARTE-MERE_Pxx_FPGA_bank0_1_5 (U1.C12), S7CAS-PLEIADES-CARTE-MERE_Pxx_PHY (R167.1)
TXD2: S7CAS-PLEIADES-CARTE-MERE_Pxx_FPGA_bank0_1_5 (U1.F13), S7CAS-PLEIADES-CARTE-MERE_Pxx_PHY (R168.1)
TXD3: S7CAS-PLEIADES-CARTE-MERE_Pxx_FPGA_bank0_1_5 (U1.D13), S7CAS-PLEIADES-CARTE-MERE_Pxx_PHY (R169.1)
TXEN: S7CAS-PLEIADES-CARTE-MERE_Pxx_FPGA_bank0_1_5 (U1.B12), S7CAS-PLEIADES-CARTE-MERE_Pxx_PHY (R164.1)
TXER: S7CAS-PLEIADES-CARTE-MERE_Pxx_FPGA_bank0_1_5 (U1.A12), S7CAS-PLEIADES-CARTE-MERE_Pxx_PHY (R165.1)
UDM: S7CAS-PLEIADES-CARTE-MERE_Pxx_FPGA_bank0_1_5 (U1.J23), S7CAS-PLEIADES-CARTE-MERE_Pxx_DDR (U3.D3)
UDQS_N: S7CAS-PLEIADES-CARTE-MERE_Pxx_FPGA_bank0_1_5 (U1.M26), S7CAS-PLEIADES-CARTE-MERE_Pxx_DDR (U3.B7)
UDQS_P: S7CAS-PLEIADES-CARTE-MERE_Pxx_FPGA_bank0_1_5 (U1.M24), S7CAS-PLEIADES-CARTE-MERE_Pxx_DDR (U3.C7)
USM0: S7CAS-PLEIADES-CARTE-MERE_Pxx_FPGA_bank0_1_5 (U1.F7), S7CAS-PLEIADES-CARTE-MERE_Pxx_MOTEUR (U8.13)
USM1: S7CAS-PLEIADES-CARTE-MERE_Pxx_FPGA_bank0_1_5 (U1.B6), S7CAS-PLEIADES-CARTE-MERE_Pxx_MOTEUR (U8.12)
USR_BTN0: S7CAS-PLEIADES-CARTE-MERE_Pxx_FPGA_bank3 (U17.N5), S7CAS-PLEIADES-CARTE-MERE_Pxx_IO_SENSOR (6 pins)
USR_BTN1: S7CAS-PLEIADES-CARTE-MERE_Pxx_FPGA_bank3 (U17.N9), S7CAS-PLEIADES-CARTE-MERE_Pxx_IO_SENSOR (6 pins)

## Assembly variants
PLEIADES_V1: not fitted C? C? R26 R? R?